# EasyEDA Pro project ProPrj_WirelessUWB_2025-08-06.epro

# Schematic Schematic1
Board Name: Board1; Create Date: 2025-03-13; Page Name: P1; Project Name: WirelessUWB; Schematic Name: Schematic1; Update Date: 2025-07-11; Company: 嘉立创EDA; Page Size: A4; Version: V1.0
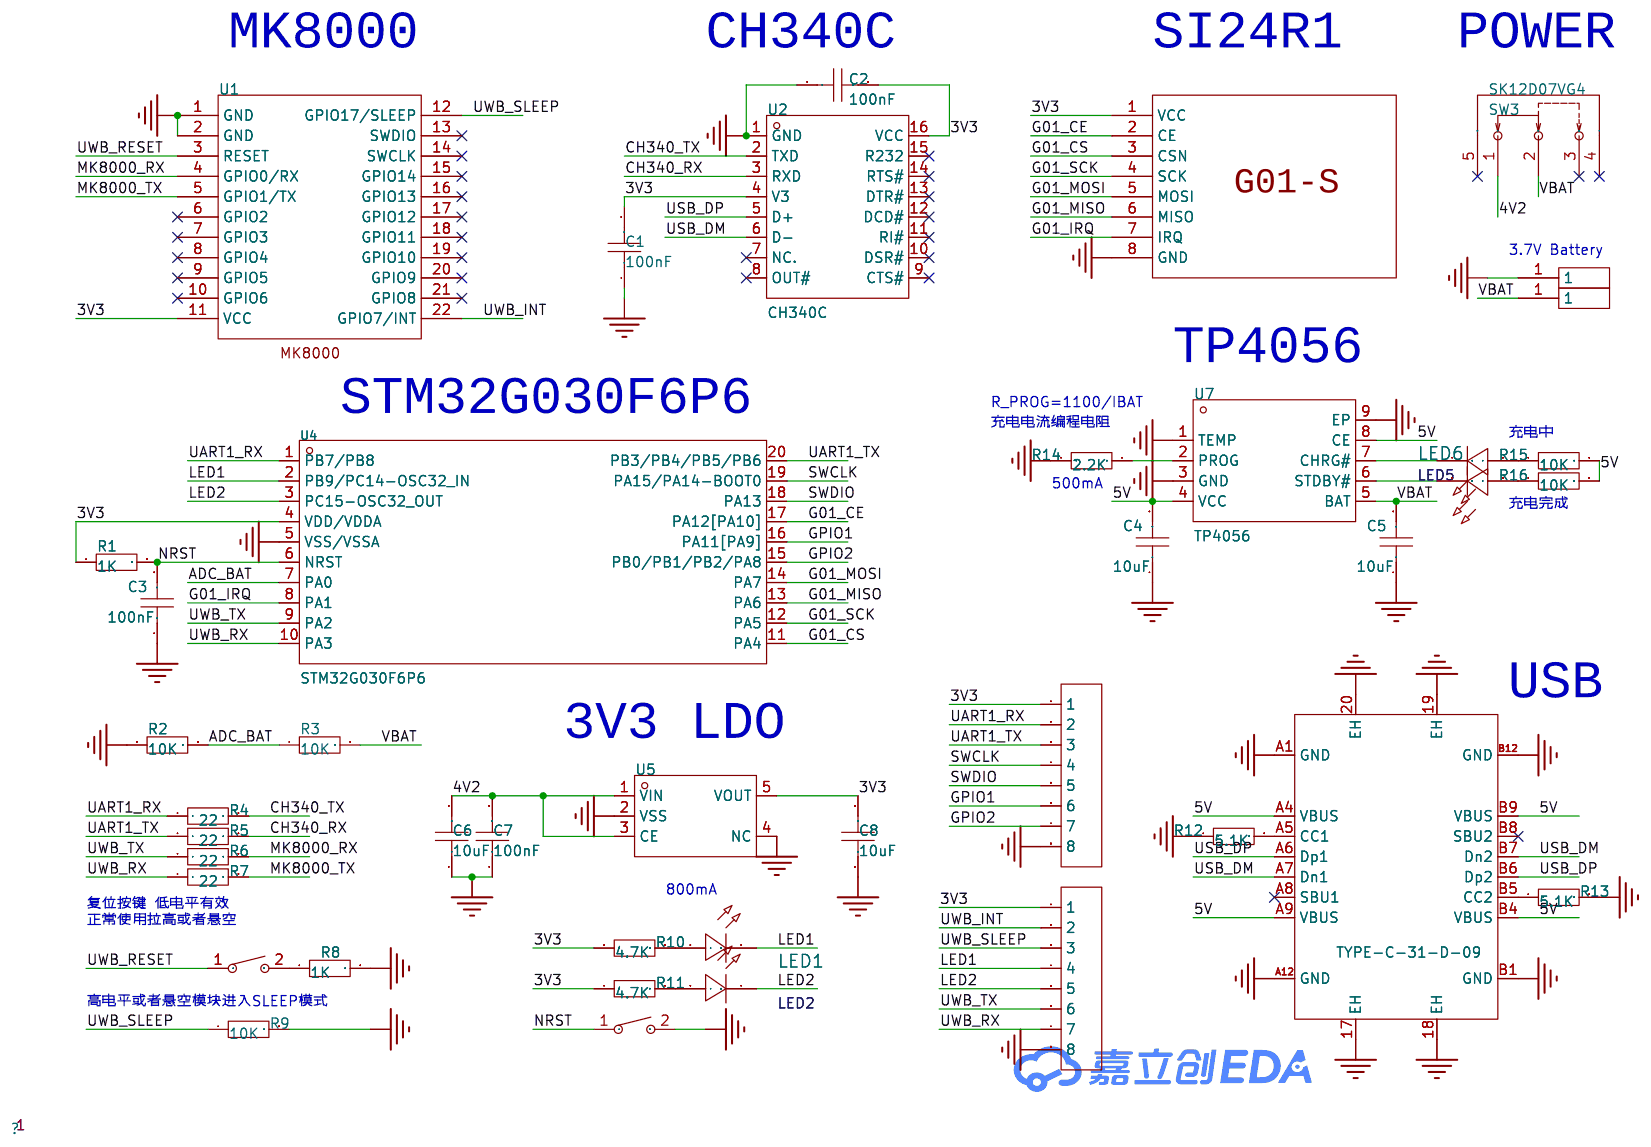
[diagram p0: schematic sheet]

## Parts
C1  100nF  [C0603]
C2  100nF  [C0603]
C3  100nF  [C0603]
C4  10uF  [C0603]
C5  10uF  [C0603]
C6  10uF  [C0603]
C7  100nF  [C0603]
C8  10uF  [C0603]
H1  -  [HDR-TH_8P-P2.54-V-F-1]
H2  -  [HDR-TH_8P-P2.54-V-F-1]
LED1  -  [LED_0603]
LED2  -  [LED_0603]
LED5  -  [LED_0603]
LED6  -  [LED_0603]
R1  1K  [R0603]
R2  10K  [R0603]
R3  10K  [R0603]
R4  22  [R0603]
R5  22  [R0603]
R6  22  [R0603]
R7  22  [R0603]
R8  1K  [R0603]
R9  10K  [R0603]
R10  4.7K  [R0603]
R11  4.7K  [R0603]
R12  5.1K  [R0603]
R13  5.1K  [R0603]
R14  2.2K  [R0603]
R15  10K  [R0603]
R16  10K  [R0603]
SW1  TS342A2P-WZ  [SW-SMD_L4.0-W2.9-LS5.0]
SW2  TS342A2P-WZ  [SW-SMD_L4.0-W2.9-LS5.0]
SW3  SK12D07VG4  [SW-TH_SK12D07VG4]
U1  -  [MK8000]
U2  CH340C  [SOP-16_L10.0-W3.9-P1.27-LS6.0-BL]
U3  -  [G01-S]
U4  STM32G030F6P6  [TSSOP-20_L6.5-W4.4-P0.65-LS6.4-BL]
U5  ME6217C33M5G  [SOT-23-5_L3.0-W1.7-P0.95-LS2.8-BR]
U6  TYPE-C-31-D-09  [USB-C-TH_TYPE-C-31-D-09]
U7  TP4056  [ESOP-8_L4.9-W3.9-P1.27-LS6.0-BL-EP]
U99  -  [1pin焊接引出]
U100  -  [1pin焊接引出]

## Library data of the parts
C1-C3 C6-C8 = CAP_0603: Supplier Footprint: 0603
C4 C5 = CL10A106KP8NNNC: 容值:10uF;精度:±10%;额定电压:10V;材质(温度系数):X5R;; LCSC Part Name: 10uF ±10% 10V; Supplier Part: C19702; Manufacturer: SAMSUNG(三星); Supplier Footprint: 0603; JLCPCB Part Class: Basic Part; Datasheet: https://atta.szlcsc.com/upload/public/pdf/source/20160218/1457707763339.pdf; Supplier: LCSC; Tolerance: ±10%; Voltage Rated: 10V; Temperature Coefficient: X5R
H1 H2 = HDR-F_2.54_1x8P: Supplier Part: C27438; Supplier Footprint: 插件
LED1 LED6 = LED_0603-R: Supplier Footprint: 0603
LED2 = LED_0603-B: Supplier Footprint: 0603
LED5 = LED_0603-G: Supplier Footprint: 0603
R1-R11 = Res_0603: Supplier Footprint: 0603
R12 R13 = 0603WAF5101T5E: 电阻类型:厚膜电阻;阻值:5.1kΩ;精度:±1%;功率:100mW;最大工作电压:75V;温度系数:±100ppm/℃;; LCSC Part Name: 5.1kΩ ±1% 100mW 厚膜电阻; Supplier Part: C23186; Manufacturer: UNI-ROYAL(厚声); Supplier Footprint: 0603; JLCPCB Part Class: Basic Part; Datasheet: https://atta.szlcsc.com/upload/public/pdf/source/20200306/C422600_1E6D84923E4A46A82E41ADD87F860B5C.pdf; Supplier: LCSC; Type: 厚膜电阻; Tolerance: ±1%; Power(Watts): 100mW; Overload Voltage (Max): 75V; Temperature Coefficient: ±100ppm/℃; Operating Temperature Range: -55℃~+155℃
R14 = 0603WAF2201T5E: 电阻类型:厚膜电阻;阻值:2.2kΩ;精度:±1%;功率:100mW;最大工作电压:75V;温度系数:±100ppm/℃;; LCSC Part Name: 2.2kΩ ±1% 100mW 厚膜电阻; Supplier Part: C4190; Manufacturer: UNI-ROYAL(厚声); Supplier Footprint: 0603; JLCPCB Part Class: Basic Part; Datasheet: https://atta.szlcsc.com/upload/public/pdf/source/20200306/C422600_1E6D84923E4A46A82E41ADD87F860B5C.pdf; Supplier: LCSC; Type: 厚膜电阻; Tolerance: ±1%; Power(Watts): 100mW; Overload Voltage (Max): 75V; Temperature Coefficient: ±100ppm/℃; Operating Temperature Range: -55℃~+155℃
R15 R16 = 0603WAF1002T5E: 电阻类型:厚膜电阻;阻值:10kΩ;精度:±1%;功率:100mW;最大工作电压:75V;温度系数:±100ppm/℃;; LCSC Part Name: 厚膜电阻 10kΩ ±1% 100mW; Supplier Part: C25804; Manufacturer: UNI-ROYAL(厚声); Supplier Footprint: 0603; JLCPCB Part Class: Basic Part; Datasheet: https://atta.szlcsc.com/upload/public/pdf/source/20200306/C422600_1E6D84923E4A46A82E41ADD87F860B5C.pdf; Supplier: LCSC; Type: 厚膜电阻; Tolerance: ±1%; Power(Watts): 100mW; Overload Voltage (Max): 75V; Temperature Coefficient: ±100ppm/℃; Operating Temperature Range: -55℃~+155℃
SW1 SW2 = TS342A2P-WZ: 电路结构:单刀单掷;按钮形状:圆形按钮;安装方式:立贴;开关长度:3.95mm;开关宽度:2.9mm;开关高度:2mm;带支架:不带;触点电流:50mA;额定电压(DC):12V;绝缘电阻:100MΩ;机械寿命:3万次;; LCSC Part Name: 3.95*2.9*2mm 立贴 轻触开关; Supplier Part: C557591; Manufacturer: SHOU HAN(首韩); Supplier Footprint: SMD; JLCPCB Part Class: 扩展库; Datasheet: https://atta.szlcsc.com/upload/public/pdf/source/20200519/C557591_B3A5A21584733303F06306F18577DA8B.pdf; Supplier: LCSC; Circuit: 单刀单掷; Actuator Style: 圆形按钮; Mounting Style: 立贴; Switch Length: 3.95mm; Switch Width: 2.9mm; Switch Height: 2mm; Strike Gundam: 不带; Contact Current: 50mA; Voltage Rating (DC): 12V; Insulation Resistance: 100MΩ; Actuator/Cap Color: 黑色; Pin Style: SMD接片; Mechanical Life: 3万次; Operating Temperature: -25℃~+70℃
SW3 = SK12D07VG4: 电路结构:单刀双掷;安装方式:-;额定电流(DC):500mA;额定电压(DC):50V;额定电流(AC):-;额定电压(AC):-;机械寿命:5千次;; LCSC Part Name: 3脚2档位 卧插 滑动开关; Supplier Part: C393937; Manufacturer: SHOU HAN(首韩); Supplier Footprint: 插件; JLCPCB Part Class: 扩展库; Datasheet: https://atta.szlcsc.com/upload/public/pdf/source/20190521/C393937_939FE26E571CC67D2D532E953108A1B0.pdf; Supplier: LCSC; Circuit: 单刀双掷; Actuator Style: 矩形柱状; Pin Style: PC引脚; Switch Height: 8.8mm; Current Rating (DC): 500mA; Voltage Rating (DC): 50V; Mechanical Life: 5千次
U1 = MK8000: UWB模块
U2 = CH340C: 应用功能:收发器;接口协议:USB 2.0;数据速率:2Mbps;; LCSC Part Name: CH340C USB转串口芯片 CH340; Supplier Part: C84681; Manufacturer: WCH(南京沁恒); Supplier Footprint: SOP-16; JLCPCB Part Class: 扩展库; Datasheet: https://atta.szlcsc.com/upload/public/pdf/source/20200819/C84681_ADBED554CE321879DBD6B1D06488689C.pdf; Supplier: LCSC; Applications Function: 收发器; Protocol: USB 2.0; Supply Voltage: 3.3V；5V; Data Rate: 2Mbps
U3 = G01-S
U4 = STM32G030F6P6: CPU内核:CM0;程序存储容量:32KB;RAM总容量:8KB;GPIO端口数量:18;工作电压范围:2V~3.6V;CPU最大主频:64MHz;程序存储器类型:FLASH;; Supplier Part: C724040; Manufacturer: ST(意法半导体); Supplier Footprint: TSSOP-20; JLCPCB Part Class: 扩展库; Datasheet: https://atta.szlcsc.com/upload/public/pdf/source/20200511/C529329_A1CB615556C746C4EA827FCAD1461480.pdf; Supplier: LCSC; CPU Core: CM0; Program Storage Size: 32KB; RAM Size: 8KB; GPIO Ports Number: 18; Operating Voltage Range: 2V~3.6V; CPU Maximum Speed: 64MHz; Program Memory Type: FLASH; Operating Temperature Range: -40℃~+85℃; ADC (Bit): 12bit; Peripheral/Function: DMA；看门狗；看门狗; Internal Oscillator: 有
U5 = ME6217C33M5G: 输出类型:固定;输出极性:正;最大输入电压:7V;输出电压:3.3V;输出电流:800mA;电源纹波抑制比(PSRR):65dB@(1kHz);; Supplier Part: C427602; Manufacturer: MICRONE(南京微盟); Supplier Footprint: SOT-23-5; JLCPCB Part Class: 扩展库; Datasheet: https://atta.szlcsc.com/upload/public/pdf/source/20190910/C427602_D4B9162A2E9D9EF57C60010DFDECEF37.pdf; Supplier: LCSC; Output Type: 固定; Output Polarity: 正; Number of Outputs: 1; Maximum Input Voltage: 7V; Output Voltage: 3.3V; Dropout Voltage: 180mV@(300mA); Output Current: 800mA; Power Supply Rejection Ratio (PSRR): 65dB@(1kHz)
U6 = TYPE-C-31-D-09_C7463258: 连接器类型:Type-C;公母:母;触点数量:16P;端口数量:1;触头材质:磷青铜;触头镀层:金;工作温度范围:-25℃~+85℃;焊接温度(最大值):255℃;; LCSC Part Name: Type-C 母; Supplier Part: C7463258; Manufacturer: 韩国韩荣; Supplier Footprint: 插件; JLCPCB Part Class: 扩展库; Datasheet: https://atta.szlcsc.com/upload/public/pdf/source/20210810/32473655767ED7E058BB8A709ED63A8A.pdf; Supplier: LCSC; Connector Type: Type-C; Gender: 母; Number of Contacts: 16P; Number of Ports: 1; Contact Material: 磷青铜; Contact Plating: 金; Operating Temperature Range: -25℃~+85℃; Soldering Temperature(Max): 255℃
U7 = TP4056_C382139: 工作电压:4V~6V;最大充电电流:1A;电池类型:锂离子/聚合物;电池节数:1;; LCSC Part Name: 1A锂电池充电IC; Supplier Part: C382139; Manufacturer: TPOWER(天源); Supplier Footprint: ESOP-8; JLCPCB Part Class: 扩展库; Datasheet: https://atta.szlcsc.com/upload/public/pdf/source/20190327/C382139_EC85960E6FE3E26856C240C81751A184.pdf; Supplier: LCSC; The Chip Type: 线性充电芯片; Supply Voltage: 4V~6V; Maximum Charge Current: 1A; Charging Saturation Voltage: 4.2V; Type of Battery: 锂离子/聚合物; Number of Cells: 1; Operating Temperature: -40℃~+85℃
U99 U100 = 1pin焊接引出: Check: false

## Nets
3V3: C1.2 C2.2 C8.2 H1.1 H2.1 R1.1 R10.1 R11.1 U1.11(VCC) U2.4(V3) U2.16(VCC) U3.1(VCC) U4.4(VDD/VDDA) U5.5(VOUT)
4V2: C6.2 C7.2 SW3.1 U5.1(VIN) U5.3(CE)
5V: C4.2 R15.2 R16.2 U6.A4(VBUS) U6.A9(VBUS) U6.B4(VBUS) U6.B9(VBUS) U7.4(VCC) U7.8(CE)
GND: C1.1 C2.1 C3.1 C4.1 C5.1 C6.1 C7.1 C8.1 H1.8 H2.8 R2.1 R8.2 R9.2 R12.1 R13.2 R14.1 SW2.2 U1.1(GND) U1.2(GND) U2.1(GND) U3.8(GND) U4.5(VSS/VSSA) U5.2(VSS) U5.4(NC) U6.17(EH) U6.18(EH) U6.19(EH) U6.20(EH) U6.A1(GND) U6.A12(GND) U6.B1(GND) U6.B12(GND) U7.1(TEMP) U7.3(GND) U7.9(EP) U99.1
VBAT: C5.2 R3.2 SW3.2 U7.5(BAT) U100.1
ADC_BAT: R2.2 R3.1 U4.7(PA0)
CH340_RX: R5.2 U2.3(RXD)
CH340_TX: R4.2 U2.2(TXD)
G01_CE: U3.2(CE) U4.17(PA12[PA10])
G01_CS: U3.3(CSN) U4.11(PA4)
G01_IRQ: U3.7(IRQ) U4.8(PA1)
G01_MISO: U3.6(MISO) U4.13(PA6)
G01_MOSI: U3.5(MOSI) U4.14(PA7)
G01_SCK: U3.4(SCK) U4.12(PA5)
GPIO1: H2.6 U4.16(PA11[PA9])
GPIO2: H2.7 U4.15(PB0/PB1/PB2/PA8)
LED1: H1.4 LED1.1(C) U4.2(PB9/PC14-OSC32_IN)
LED2: H1.5 LED2.1(C) U4.3(PC15-OSC32_OUT)
MK8000_RX: R6.2 U1.4(GPIO0/RX)
MK8000_TX: R7.2 U1.5(GPIO1/TX)
NRST: C3.2 R1.2 SW2.1 U4.6(NRST)
SWCLK: H2.4 U4.19(PA15/PA14-BOOT0)
SWDIO: H2.5 U4.18(PA13)
UART1_RX: H2.2 R4.1 U4.1(PB7/PB8)
UART1_TX: H2.3 R5.1 U4.20(PB3/PB4/PB5/PB6)
USB_DM: U2.6(D-) U6.A7(Dn1) U6.B7(Dn2)
USB_DP: U2.5(D+) U6.A6(Dp1) U6.B6(Dp2)
UWB_INT: H1.2 U1.22(GPIO7/INT)
UWB_RESET: SW1.1 U1.3(RESET)
UWB_RX: H1.7 R7.1 U4.10(PA3)
UWB_SLEEP: H1.3 R9.1 U1.12(GPIO17/SLEEP)
UWB_TX: H1.6 R6.1 U4.9(PA2)
$1N3135: LED6.1(C) U7.7(CHRG#)
$1N3136: LED5.1(C) U7.6(STDBY#)
Net-(LED1-2): LED1.2(A) R10.2
Net-(LED2-2): LED2.2(A) R11.2
Net-(LED5-2): LED5.2(A) R16.1
Net-(LED6-2): LED6.2(A) R15.1
Net-(R8-1): R8.1 SW1.2
Net-(R12-2): R12.2 U6.A5(CC1)
Net-(R13-1): R13.1 U6.B5(CC2)
Net-(R14-2): R14.2 U7.2(PROG)

Not connected (* = marked no-connect by the designer): SW3 3* 4* 5*; U1 6(GPIO2)* 7(GPIO3)* 8(GPIO4)* 9(GPIO5)* 10(GPIO6)* 13(SWDIO)* 14(SWCLK)* 15(GPIO14)* 16(GPIO13)* 17(GPIO12)* 18(GPIO11)* 19(GPIO10)* 20(GPIO9)* 21(GPIO8)*; U2 7(NC.)* 8(OUT#)* 9(CTS#)* 10(DSR#)* 11(RI#)* 12(DCD#)* 13(DTR#)* 14(RTS#)* 15(R232)*; U6 A8(SBU1)* B8(SBU2)*

## Notes on the sheet
- MK8000
- CH340C
- SI24R1
- POWER
- 3.7V Battery
- TP4056
- STM32G030F6P6
- R_PROG=1100/IBAT
- 充电电流编程电阻
- 充电中
- 500mA
- 充电完成
- USB
- 3V3 LDO
- 800mA
- 复位按键 低电平有效
  正常使用拉高或者悬空
- 高电平或者悬空模块进入SLEEP模式

# Board PCB1
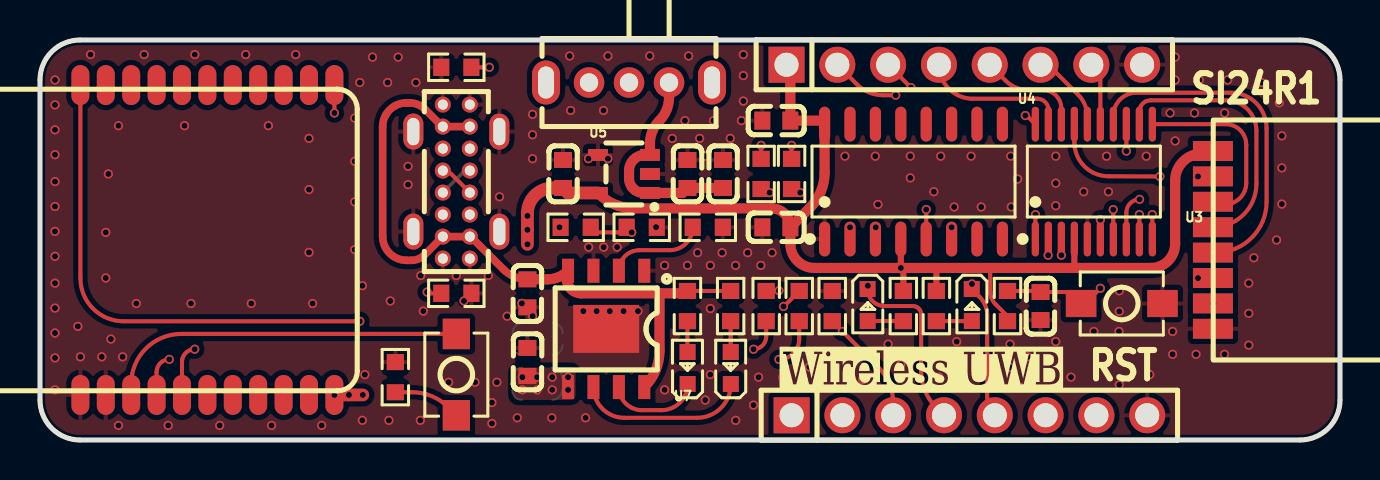
[diagram p1: board, top side]
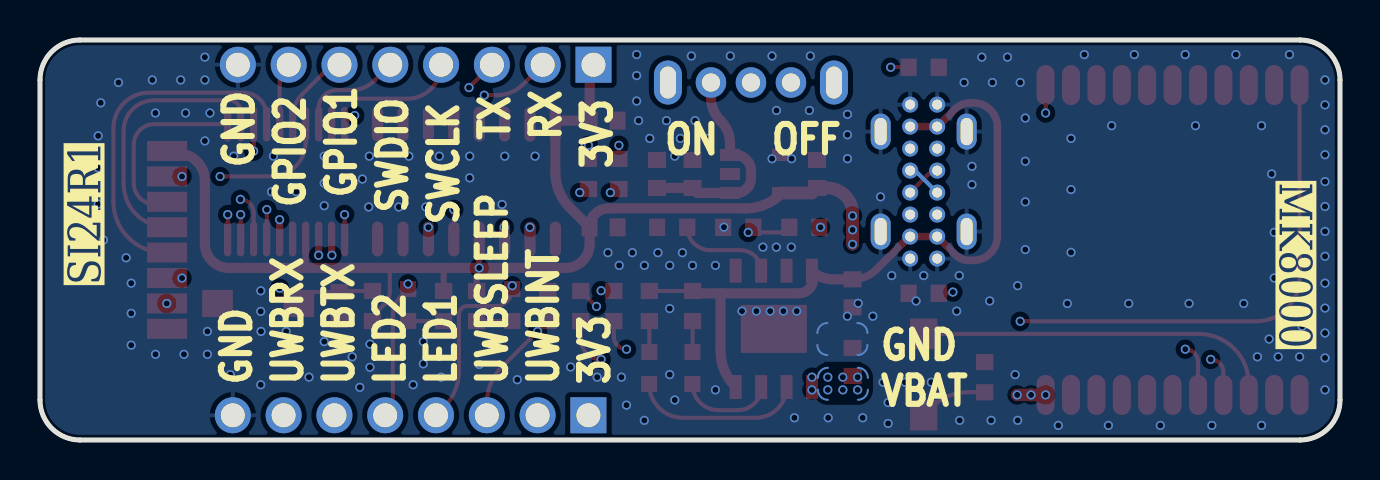
[diagram p2: board, bottom side, seen from below]

Outline 65 x 20 mm; copper layers: Top Layer, Inner1, Inner2, Bottom Layer. Coordinates in mm from the lower left corner of the outline.
Outline path: 0,18 0,2 arc(0.59,0.59) 2,0 63,0 arc(64.41,0.59) 65,2 65,18 arc(64.41,19.41) 63,20 2,20 arc(0.59,19.41) 0,18
Stack: Top Layer 0.035mm 外层铜厚1oz / Dielectric1 0.2104mm 7628 RC49% 8.6mil / Inner1 0.0152mm 内层铜厚 / Dielectric2 1.065mm 1.1mm H/HOZ Copper / Inner2 0.0152mm 内层铜厚 / Dielectric3 0.2104mm 7628 RC49% 8.6mil / Bottom Layer 0.035mm 外层铜厚1oz

## Design rules (mm)
template: 自定义配置
spacing copperThickness1oz (default): track to track 0.102, other pairs 0.152 to 0.3
spacing copperThickness2oz: track to track 0.203, other pairs 0.152 to 0.3
track width copperThickness1oz (default): min 0.127, default 0.254, max 2.54
track width copperThickness2oz: min 0.203, default 0.254, max 2.54
differential pair differentialPair (default): width min 0.127, default 0.254, max 2.54; gap min 0.152, default 0.152
via viaSize (default): diameter min 0.254, default 0.457, max 10; hole min 0.3, default 0.305, max 6.3

## Placement (name value [footprint] x y rotation side)
C9  100nF  [C0603]  50.03 6.7 90 top
C12  100nF  [C0603]  32.37 13.3 270 top
C13  10uF  [C0603]  34.15 13.3 270 top
C14  10uF  [C0603]  26.15 13.3 270 top
C30  10uF  [C0603]  24.37 3.9 270 top
C31  10uF  [C0603]  24.37 7.33 90 top
C68  100nF  [C0603]  36.82 10.64 0 top
C69  100nF  [C0603]  36.82 15.97 0 top
H1  -  [HDR-TH_8P-P2.54-V-F-1]  46.47 1.24 0 top
H2  -  [HDR-TH_8P-P2.54-V-F-1]  46.22 18.76 0 top
LED1  -  [LED_0603]  41.39 6.7 270 top
LED2  -  [LED_0603]  46.6 6.7 270 top
LED5  -  [LED_0603]  34.53 3.65 90 top
LED6  -  [LED_0603]  32.37 3.65 90 top
R1  1K  [R0603]  17.77 3.14 90 top
R2  10K  [R0603]  39.61 6.7 90 top
R4  22  [R0603]  33.39 10.64 180 top
R5  22  [R0603]  48.38 6.7 90 top
R6  22  [R0603]  43.17 6.7 270 top
R7  22  [R0603]  44.82 6.7 270 top
R8  1K  [R0603]  30.09 10.64 180 top
R9  10K  [R0603]  26.78 10.64 180 top
R46  5.1K  [R0603]  20.82 7.33 180 top
R47  5.1K  [R0603]  20.82 18.64 180 top
R48  10K  [R0603]  32.37 6.7 90 top
R49  10K  [R0603]  34.53 6.7 90 top
R50  22  [R0603]  36.06 13.3 270 top
R51  22  [R0603]  37.58 13.3 270 top
R52  22  [R0603]  37.96 6.7 270 top
R53  22  [R0603]  36.31 6.7 270 top
SW1  TS342A2P-WZ  [SW-SMD_L4.0-W2.9-LS5.0]  20.82 3.27 270 top
SW2  TS342A2P-WZ  [SW-SMD_L4.0-W2.9-LS5.0]  54.09 6.83 0 top
SW3  SK12D07VG4  [SW-TH_SK12D07VG4]  29.45 17.87 180 top
U1  -  [MK8000]  15.86 10 90 top
U2  CH340C  [SOP-16_L10.0-W3.9-P1.27-LS6.0-BL]  43.68 12.92 0 top
U3  -  [G01-S]  58.66 10 0 top
U4  STM32G030F6P6  [TSSOP-20_L6.5-W4.4-P0.65-LS6.4-BL]  52.69 12.92 0 top
U5  ME6217C33M5G  [SOT-23-5_L3.0-W1.7-P0.95-LS2.8-BR]  29.2 13.3 0 top
U6  TYPE-C-31-D-09  [USB-C-TH_TYPE-C-31-D-09]  20.82 12.92 90 top
U7  TP4056  [ESOP-8_L4.9-W3.9-P1.27-LS6.0-BL-EP]  28.31 5.56 180 top
U99  -  [1pin焊接引出]  24.88 5.05 0 bottom
U100  -  [1pin焊接引出]  24.86 2.81 0 bottom

## Footprints (pads in the part's own frame, mm; a bottom-side part is the same pattern mirrored in y, then rotated)
1pin焊接引出
  custom 2.5x1.6 smd: 1(0,0)
C0603
  rect 0.8x0.9 smd: 1(-0.7,0) 2(0.7,0)
ESOP-8_L4.9-W3.9-P1.27-LS6.0-BL-EP
  rect 0.6x1.2 smd: 1(-1.905,-2.909) 2(-0.635,-2.909) 3(0.635,-2.909) 4(1.905,-2.909) 5(1.905,2.909) 6(0.635,2.909) 7(-0.635,2.909) 8(-1.905,2.909)
  rect 3.3x2.4 smd: 9(0,0)
G01-S
  custom 2x1 smd: 1(-0.016,4.45) 2(-0.016,3.18) 3(-0.016,1.91) 4(-0.016,0.64) 5(-0.016,-0.63) 6(-0.016,-1.9) 7(-0.016,-3.17) 8(-0.016,-4.44)
HDR-TH_8P-P2.54-V-F-1
  rect 1.8x1.8 hole 1.2: 1(-8.89,0)
  round 1.8 hole 1.2: 2(-6.35,0) 3(-3.81,0) 4(-1.27,0) 5(1.27,0) 6(3.81,0) 7(6.35,0) 8(8.89,0)
LED_0603
  rect 0.8x0.8 smd: 1(-0.851,-0.01) 2(0.75,-0.005)
MK8000
  oval 2x0.9 smd: 1(-7.747,13.843) 2(-7.747,12.573) 3(-7.747,11.303) 4(-7.747,10.033) 5(-7.747,8.763) 6(-7.747,7.493) 7(-7.747,6.223) 8(-7.747,4.953) 9(-7.747,3.683) 10(-7.747,2.413) 11(-7.747,1.143) 12(7.747,13.843) 13(7.747,12.573) 14(7.747,11.303) 15(7.747,10.033) 16(7.747,8.763) 17(7.747,7.493) 18(7.747,6.223) 19(7.747,4.953) 20(7.747,3.683) 21(7.747,2.413) 22(7.747,1.143)
R0603
  rect 0.806x0.864 smd: 1(-0.753,0) 2(0.753,0)
SOP-16_L10.0-W3.9-P1.27-LS6.0-BL
  oval 0.56x1.745 smd: 1(-4.445,-2.873) 2(-3.175,-2.873) 3(-1.905,-2.873) 4(-0.635,-2.873) 5(0.635,-2.873) 6(1.905,-2.873) 7(3.175,-2.873) 8(4.445,-2.873) 9(4.445,2.873) 10(3.175,2.873) 11(1.905,2.873) 12(0.635,2.873) 13(-0.635,2.873) 14(-1.905,2.873) 15(-3.175,2.873) 16(-4.445,2.873)
SOT-23-5_L3.0-W1.7-P0.95-LS2.8-BR
  rect 1x0.6 smd: 1(1.3,-0.95) 2(1.3,0) 3(1.3,0.95) 4(-1.3,0.95) 5(-1.3,-0.95)
SW-SMD_L4.0-W2.9-LS5.0
  rect 1.53x1.36 smd: 1(-2.035,0) 2(2.035,0)
SW-TH_SK12D07VG4
  round 1.524 hole 0.914: 1(-2,0) 2(0,0) 3(2,0)
  oval 1.4x2.2 hole 0.8x1.6: 4(4.15,0) 5(-4.15,0)
TSSOP-20_L6.5-W4.4-P0.65-LS6.4-BL
  oval 0.364x1.742 smd: 1(-2.925,-2.871) 2(-2.275,-2.871) 3(-1.625,-2.871) 4(-0.975,-2.871) 5(-0.325,-2.871) 6(0.325,-2.871) 7(0.975,-2.871) 8(1.625,-2.871) 9(2.275,-2.871) 10(2.925,-2.871) 11(2.925,2.871) 12(2.275,2.871) 13(1.625,2.871) 14(0.975,2.871) 15(0.325,2.871) 16(-0.325,2.871) 17(-0.975,2.871) 18(-1.625,2.871) 19(-2.275,2.871) 20(-2.925,2.871)
USB-C-TH_TYPE-C-31-D-09
  oval 1.8x1 hole 1.365x0.6: 17(2.5,2.15) 18(-2.5,2.15) 19(-2.5,-2.15) 20(2.5,-2.15)
  round 0.8 hole 0.5: A1(-3.85,0.675) A4(-2.75,0.675) A5(-1.65,0.675) A6(-0.55,0.675) A7(0.55,0.675) A8(1.65,0.675) A9(2.75,0.675) A12(3.85,0.675) B1(3.85,-0.675) B4(2.75,-0.675) B5(1.65,-0.675) B6(0.55,-0.675) B7(-0.55,-0.675) B8(-1.65,-0.675) B9(-2.75,-0.675) B12(-3.85,-0.675)

## Nets
3V3: C14.2 C68.2 C69.2 H1.1 H2.1 R5.1 R6.1 R7.1 U1.11 U2.4 U2.16 U3.1 U4.4 U5.5
4V2: C12.2 C13.2 SW3.1 U5.1 U5.3
5V: C31.2 R48.2 R49.2 U6.A4 U6.A9 U6.B4 U6.B9 U7.4 U7.8
GND: C9.1 C12.1 C13.1 C14.1 C30.1 C31.1 C68.1 C69.1 H1.8 H2.8 R1.2 R2.2 R4.1 R8.1 R46.1 R47.2 SW2.2 U1.1 U1.2 U2.1 U3.8 U4.5 U5.2 U5.4 U6.17 U6.18 U6.19 U6.20 U6.A1 U6.A12 U6.B1 U6.B12 U7.1 U7.3 U7.9 U99.1
VBAT: C30.2 R9.2 SW3.2 U7.5 U100.1
ADC_BAT: R8.2 R9.1 U4.7
CH340_RX: R51.2 U2.3
CH340_TX: R50.2 U2.2
G01_CE: U3.2 U4.17
G01_CS: U3.3 U4.11
G01_IRQ: U3.7 U4.8
G01_MISO: U3.6 U4.13
G01_MOSI: U3.5 U4.14
G01_SCK: U3.4 U4.12
GPIO1: H2.6 U4.16
GPIO2: H2.7 U4.15
LED1: H1.4 LED1.1 U4.2
LED2: H1.5 LED2.1 U4.3
MK8000_RX: R52.2 U1.4
MK8000_TX: R53.2 U1.5
NRST: C9.2 R5.2 SW2.1 U4.6
SWCLK: H2.4 U4.19
SWDIO: H2.5 U4.18
UART1_RX: H2.2 R50.1 U4.1
UART1_TX: H2.3 R51.1 U4.20
USB_DM: U2.6 U6.A7 U6.B7
USB_DP: U2.5 U6.A6 U6.B6
UWB_INT: H1.2 U1.22
UWB_RESET: SW1.1 U1.3
UWB_RX: H1.7 R53.1 U4.10
UWB_SLEEP: H1.3 R2.1 U1.12
UWB_TX: H1.6 R52.1 U4.9
$1N736: R1.1 SW1.2
$1N2070: LED1.2 R6.2
$1N2071: LED2.2 R7.2
$1N2718: R46.2 U6.A5
$1N2719: R47.1 U6.B5
$1N3128: R4.2 U7.2
$1N3135: LED6.1 U7.7
$1N3136: LED5.1 U7.6
$1N3139: LED6.2 R48.1
$1N3145: LED5.2 R49.1

Pads without a net: SW3 3 4 5; U1 6 7 8 9 10 13 14 15 16 17 18 19 20 21; U2 7 8 9 10 11 12 13 14 15; U6 A8 B8

## Via types
v1: diameter 0.457, hole 0.305, Top Layer to Bottom Layer, 239 vias

## Routing (per net, layer and track width the routed paths; a pad name or vN(x,y) marks a point on that pad's centre or on a via; arc(x,y) is an arc through that point)
3V3: length 87.3
  Top Layer w0.203: 47.51,8.48 47.51,7.43 arc(47.58,7.09) 47.77,6.79 48.38,6.19 R5.1
  Top Layer w0.305: U2.4 v1(43.04,8.6) 43.04,8.49 ; 51.72,8.51 U4.4 ; R7.1 44.82,8.48 ; R6.1 43.17,8.36
  Top Layer w0.508: 58.28,14.45 U3.1 ; U5.5 27.93,12.32 arc(28.36,11.97) 28.87,11.73 arc(29.29,11.62) 29.72,11.58 36.57,11.58 arc(37.24,11.3) C68.2 ; 51.7,8.6 55.56,8.6 arc(56.4,8.96) 56.76,9.81 56.76,12.97 arc(57.15,13.92) 58.1,14.32 58.28,14.32 ; C68.2 37.52,9.81 arc(37.87,8.96) 38.72,8.6 v1(43.04,8.6) 51.56,8.6 ; C68.2 38.51,11.63 arc(39.04,12.43) 39.23,13.36 U2.16 39.06,15.97 C69.2 37.52,18.57 H2.1
  Top Layer w0.635: v1(14.72,2.25) v1(15.45,2.25) v1(16.14,2.25) ; U5.5 26.4,12.35 C14.2 25.64,12.6 arc(24.74,12.23) 24.37,11.33 v1(24.37,10.51) v1(24.37,9.78)
  Inner2 w0.381: v1(43.04,8.6) 43.04,7.88 arc(42.85,6.9) 42.3,6.08 37.67,1.45 arc(37.6,1.35) H1.1
  Inner2 w0.635: v1(24.37,11.2) v1(24.37,10.51) 24.37,9.66 arc(24.18,8.68) 23.63,7.86 18.77,3 arc(17.94,2.45) 16.97,2.25 v1(16.14,2.25) v1(15.45,2.25) v1(14.72,2.25)
4V2: length 11
  Top Layer w0.508: C13.2 C12.2 32.12,12.35 U5.1 30.18,12.35 arc(29.96,12.39) 29.76,12.49 arc(29.67,12.57) 29.59,12.66 arc(29.49,12.86) 29.45,13.08 29.45,13.46 arc(29.68,14.02) 30.24,14.25 U5.3 30.5,14.83 arc(30.62,15.44) 30.97,15.96 arc(31.33,16.5) 31.45,17.13 SW3.1
5V: length 36.2
  Top Layer w0.203: R48.2 R49.2
  Top Layer w0.381: U6.B4 U6.A9 20.12,15.67 19.25,16.53 arc(18.89,16.77) 18.47,16.86 18.33,16.86 arc(18.02,16.82) 17.74,16.7 arc(17.48,16.51) 17.29,16.25 arc(17.17,15.97) 17.13,15.66 17.13,10.18 arc(17.48,9.33) 18.33,8.98 18.57,8.98 arc(18.93,9.05) 19.23,9.26 U6.A4 U6.B9 21.53,10.17 23.18,8.53 arc(23.73,8.16) C31.2
  Top Layer w0.508: R48.2 32.25,7.33 30.97,7.33 ; 26.4,8.09 U7.4 arc(25.93,8.14) 25.37,8.03 C31.2 ; 30.97,7.33 30.98,7.32 30.98,4.46 arc(30.78,3.49) 30.23,2.67 U7.8 ; 30.97,7.33 27.06,7.33 arc(26.55,7.54) 26.34,8.05
GND:
  vias: v1(0.75,18) v1(0.75,16.76) v1(0.75,15.51) v1(0.75,14.26) v1(0.75,12.92) v1(0.75,11.68) v1(0.75,10.43) v1(0.75,9.18) v1(0.75,7.84) v1(0.75,6.6) v1(0.75,5.35) v1(0.75,4.1) v1(0.75,2.51) v1(1.89,5.68) v1(2.02,4.16) v1(2.53,19.27) v1(3.09,4.16) v1(3.29,10.38) v1(3.29,8.1) v1(3.42,13.3) v1(3.54,5.05) v1(3.92,15.72) v1(3.92,0.73) v1(4.13,4.16) v1(4.81,6.83) v1(5.21,19.27) v1(6.41,0.73) v1(7.23,15.72) v1(7.55,6.83) v1(7.74,19.27) v1(8.98,0.73) v1(10.28,19.27) v1(10.56,6.83) v1(11.42,15.72) v1(11.58,0.73) v1(12.78,19.27) v1(13.45,15.08) v1(13.45,12.52) v1(13.45,9.38) v1(13.63,6.83) v1(14.08,0.73) v1(15.74,16.1) v1(15.74,13.94) v1(15.74,11.91) v1(15.74,9.52) v1(15.99,17.87) v1(16.12,7.71) v1(16.12,0.98) v1(16.24,3.27) v1(16.62,19.14) v1(17.38,17.87) v1(17.45,0.98) v1(17.51,6.95) v1(17.91,19.14) v1(18.4,13.68) v1(18.4,12.77) v1(18.79,17.87) v1(19.04,8.22) v1(19.02,0.98) v1(19.16,6.44) v1(20.44,2.89) v1(20.81,8.22) v1(21.2,6.95) v1(21.75,2.89) v1(22.42,8.22) v1(22.59,1.87) v1(22.59,0.83) v1(22.84,2.89) v1(22.97,12.16) v1(23.36,6.19) v1(23.86,1.11) v1(24.09,6.83) v1(24.63,16.28) v1(24.63,15.26) v1(24.63,14.06) v1(24.63,6.19) v1(25.59,1.11) v1(26.48,19.2) v1(26.53,16.48) v1(27.17,6.44) v1(27.28,1.11) v1(27.42,14.06) v1(27.44,9.64) v1(27.83,6.44) v1(28.18,16.48) v1(28.18,9.64) v1(28.4,19.2) v1(28.4,14.06) v1(28.49,6.44) v1(28.85,9.64) v1(29.18,6.44) v1(29.9,6.44) v1(30.49,19.2) v1(30.8,10.64) v1(31.23,8.73) v1(31.23,2.51) v1(31.61,15.08) v1(32.25,15.97) v1(32.43,19.2) v1(32.37,8.73) v1(32.88,9.36) v1(32.98,15.08) v1(33.26,14.19) v1(33.26,2) v1(33.52,8.73) v1(33.52,6.57) v1(33.52,3.27) v1(33.67,15.97) v1(34.1,9.36) v1(34.51,15.08) v1(34.78,8.73) v1(34.79,0.98) v1(35.07,15.97) v1(35.17,19.27) v1(35.17,18.22) v1(35.17,16.95) v1(35.38,9.36) v1(35.68,1.75) v1(35.93,3.14) v1(36.04,8.73) v1(36.6,9.36) v1(37.14,3.14) v1(38.47,3.65) v1(40.25,14.19) v1(41.14,3.02) v1(41.76,14.19) v1(41.9,11.78) v1(42.41,4.79) v1(43.04,3.78) v1(43.51,14.19) v1(43.51,13.11) v1(44.69,12.41) v1(44.95,3.14) v1(45.04,14.19) v1(45.71,11.65) v1(45.84,4.92) v1(45.84,3.81) v1(46.34,2.76) v1(46.55,14.19) v1(47.06,11.65) v1(48.53,14.19) v1(48.5,4.79) v1(48.5,3.64) v1(48.56,11.65) v1(48.88,13.05) v1(49.01,2.63) v1(49.39,4.16) v1(50.79,14.19) v1(50.79,12.84) v1(50.79,11.71) v1(50.79,4.92) v1(51.55,3.14) v1(52.19,12.41) v1(52.69,5.43) v1(53.33,14.19) v1(53.42,12.41) v1(53.95,5.43) v1(53.96,7.46) v1(53.96,6.43) v1(53.96,2.76) v1(55.31,14.19) v1(55.49,3.27) v1(56.5,16.35) v1(56.63,5.43) v1(56.63,4.28) v1(56.76,19.14) v1(56.76,18) v1(56.76,14.95) v1(57.72,16.35) v1(57.8,4.28) v1(57.97,18) v1(59.23,16.35) v1(59.23,4.28) v1(59.38,18) v1(60.44,7.84) v1(60.44,6.33) v1(60.44,4.74) v1(60.69,9.11) v1(61.07,17.87) v1(61.83,10) v1(61.96,16.86) v1(62.09,15.21) v1(62.09,13.61) v1(62.09,11.8)
VBAT: length 2.4
  Inner2 w1.27: SW3.2 29.45,15.46
  vias: v1(24.12,3.14) v1(24.12,2.51) v1(24.86,3.14) v1(24.86,2.51) v1(25.61,3.14) v1(25.61,2.51) v1(25.97,10.64) v1(26.4,3.14) v1(26.4,2.5)
ADC_BAT: length 28.2
  Top Layer w0.203: R9.1 27.79,10.38 v1(29.59,10.38) ; v1(53.66,11.52) 53.66,10.06 U4.7
  Inner1 w0.203: v1(53.66,11.52) 52.82,11.52 arc(52.75,11.52) 52.68,11.52 arc(51.93,11.33) 51.3,10.89 51.15,10.74 arc(50.33,10.19) 49.35,10 30.51,10 arc(30.01,10.1) v1(29.59,10.38)
CH340_RX: length 4.4
  Inner1 w0.203: v1(38.01,12.37) 38.02,12.38 38.99,12.38 arc(39.96,12.19) 40.79,11.64 v1(41.79,10.64)
CH340_TX: length 4.5
  Inner1 w0.203: v1(40.5,10.64) 40.06,11.07 arc(39.24,11.63) 38.27,11.82 37.81,11.82 arc(37.09,11.96) v1(36.48,12.37)
G01_CE: length 8.1
  Top Layer w0.203: U4.17 51.72,14.89 arc(52.22,13.69) 53.42,13.19 v1(56,13.17)
  Inner1 w0.203: v1(56,13.17) v1(57.9,13.17)
G01_CS: length 9.5
  Top Layer w0.203: U4.11 59.28,15.79 arc(60.01,15.49) 60.31,14.76 60.31,12.85 arc(60.3,12.66) 60.24,12.47 arc(60,12.1) 59.63,11.85 arc(59.44,11.8) 59.24,11.78 58.77,11.78 U3.3
G01_IRQ: length 10.8
  Top Layer w0.203: U4.8 54.32,11.37 arc(54.51,11.84) v1(54.98,12.03)
  Inner1 w0.203: v1(58.66,6.83) 58.66,11.02 arc(58.36,11.73) 57.65,12.03 v1(54.98,12.03)
G01_MISO: length 11.3
  Top Layer w0.203: U4.13 v1(54.32,14.44) ; U3.6 58.64,8.09 v1(57.9,8.09)
  Inner1 w0.203: v1(54.32,14.44) 54.32,9.86 arc(54.83,8.61) 56.08,8.09 v1(57.9,8.09)
G01_MOSI: length 17.6
  Top Layer w0.203: U3.5 58.79,9.37 arc(59.27,9.42) 59.74,9.56 arc(60.58,10.11) 61.14,10.96 arc(61.28,11.42) 61.33,11.91 61.33,15.59 arc(60.81,16.85) 59.55,17.37 54.82,17.37 arc(54.01,17.03) 53.67,16.21 U4.14
G01_SCK: length 13.7
  Top Layer w0.203: U4.12 54.97,16.42 arc(54.98,16.53) 55.01,16.64 arc(55.13,16.82) 55.32,16.94 arc(55.42,16.97) 55.53,16.98 59.3,16.98 arc(60.37,16.54) 60.82,15.46 60.82,12.81 arc(60.18,11.28) U3.4
GPIO1: length 3.7
  Top Layer w0.203: 50.41,18.76 51.91,17.26 arc(52.25,16.75) 52.37,16.15 U4.16
GPIO2: length 2.5
  Top Layer w0.203: U4.15 53.02,18.31
LED1: length 18.7
  Top Layer w0.203: H1.4 44.8,1.64 arc(44.25,2.46) 44.06,3.43 44.06,6.28 arc(44.04,6.41) 43.98,6.52 arc(43.93,6.58) 43.88,6.62 arc(43.76,6.68) 43.64,6.7 42.23,6.7 arc(41.63,6.95) LED1.1 41.39,7.56 v1(41.39,7.71)
  Inner1 w0.203: v1(50.41,9.24) 43.42,9.24 arc(42.16,8.8) v1(41.39,7.71)
LED2: length 13
  Top Layer w0.203: 46.6,7.54 46.98,7.16 arc(47.17,6.91) 47.3,6.63 arc(47.34,6.44) 47.36,6.24 47.36,2.16 arc(47.46,1.66) H1.5 ; 46.6,7.54 LED2.1 ; 46.6,7.54 v1(46.6,7.8) ; U4.3 v1(51.07,9.24)
  Inner1 w0.203: v1(46.6,7.8) arc(47,8.51) 47.78,8.73 50.56,8.73 arc(50.92,8.88) v1(51.07,9.24)
MK8000_RX: length 35.1
  Top Layer w0.203: U1.4 5.83,3.4 arc(6.02,3.85) v1(6.47,4.03) ; R52.2 37.96,5.05 arc(37.66,4.33) v1(36.94,4.03)
  Inner1 w0.203: v1(6.47,4.03) v1(36.94,4.03)
MK8000_TX: length 32.4
  Top Layer w0.203: R53.2 36.31,5.17 arc(36.12,4.72) v1(35.68,4.54) ; U1.5 7.1,3.9 arc(7.1,3.98) 7.12,4.05 arc(7.29,4.35) 7.59,4.52 arc(7.66,4.53) v1(7.73,4.54)
  Inner1 w0.203: v1(7.73,4.54) v1(35.68,4.54)
NRST: length 9.6
  Top Layer w0.203: U4.6 v1(53.02,11.02) ; v1(53.02,7.59) 52.26,6.83 SW2.1 51.48,7.4 C9.2 49.97,7.45 R5.2
  Inner1 w0.203: v1(53.02,11.02) v1(53.02,7.59)
SWCLK: length 6.8
  Top Layer w0.203: 50.43,16.5 arc(50.42,16.54) 50.42,16.59 arc(50.23,16.93) 49.86,17.06 46.65,17.06 arc(45.44,17.56) H2.4
SWDIO: length 5.3
  Top Layer w0.203: U4.18 51.07,16.58 arc(50.8,17.23) 50.15,17.49 49.44,17.49 arc(48.81,17.62) 48.28,17.97 H2.5
UART1_RX: length 23
  Top Layer w0.203: U4.1 49.77,11.27 v1(49.77,11.27) ; H2.2 40.85,17.78 arc(41.45,17.38) 42.15,17.24 v1(42.79,17.24) ; v1(36.06,14.73) R50.1
  Inner1 w0.203: v1(49.77,11.27) 49.77,13.72 arc(49.19,15.13) 47.77,15.72 45.36,15.72 arc(44.39,15.91) 43.57,16.46 v1(42.79,17.24) ; v1(36.06,14.73) 36.06,15.72 arc(36.5,16.79) 37.58,17.24 38.34,17.24 arc(38.46,17.24) 38.58,17.26 arc(39.42,17.69) 39.85,18.52 arc(39.86,18.64) H2.2
UART1_TX: length 16.5
  Top Layer w0.203: H2.3 v1(43.55,17.62) ; v1(37.58,14.73) R51.1 ; v1(49.26,16.22) 49.34,16.22 U4.20
  Inner1 w0.203: v1(43.55,17.62) 44.2,16.97 arc(45.03,16.42) 46,16.22 v1(49.26,16.22) ; v1(37.58,14.73) 37.58,15.33 arc(37.99,16.32) 38.98,16.73 40.37,16.73 arc(41.81,17.33) H2.3
USB_DM: length 27.3
  Top Layer w0.203: U6.B7 20.57,13.29 arc(20.37,13.42) U6.A7 ; v1(45.58,10.64) U2.6
  Inner1 w0.203: v1(45.58,10.64) 45.09,10.64 arc(45.03,10.64) 44.98,10.64 arc(44.07,10.85) 43.29,11.38 42.54,12.13 arc(41.71,12.68) 40.74,12.88 22.71,12.88 arc(22.05,12.74) U6.B7
USB_DP: length 26.5
  Top Layer w0.203: v1(44.31,11.52) 44.31,10.05
  Inner1 w0.203: U6.B6 arc(21.68,13.35) 21.9,13.3 40.97,13.3 arc(41.95,13.11) 42.77,12.56 43.44,11.88 arc(43.84,11.62) v1(44.31,11.52)
  Bottom Layer w0.203: U6.A6 21.24,13.47
UWB_INT: length 40
  Top Layer w0.203: v1(14.72,16.35) U1.22
  Inner1 w0.203: H1.2 40.12,2.51 arc(39.99,3.31) 39.61,4.03 arc(39.38,4.3) 39.1,4.54 arc(38.38,4.92) 37.58,5.05 16.55,5.05 arc(16.28,5.07) 16.02,5.13 arc(15.26,5.58) 14.8,6.34 arc(14.74,6.61) 14.72,6.88 v1(14.72,16.35)
UWB_RESET: length 18.2
  Top Layer w0.203: SW1.1 7.06,5.3 arc(5.29,4.57) 4.56,2.8 U1.3
UWB_RX: length 33.1
  Top Layer w0.203: v1(55.61,11.27) 55.61,10.05 U4.10 ; R53.1 36.32,7.46 v1(36.94,7.46)
  Inner1 w0.203: H1.7 52.82,1.75 arc(51.22,5.61) 47.36,7.21 37.57,7.21 arc(37.23,7.27) v1(36.94,7.46)
  Inner2 w0.203: H1.7 52.82,2.51 arc(53.23,3.49) 54.22,3.9 arc(55.2,4.31) 55.61,5.3 v1(55.61,11.27)
UWB_SLEEP: length 55
  Top Layer w0.203: H1.3 42.66,1.84 arc(42.47,2.82) 41.92,3.64 R2.1 ; U1.12 2.02,8.09 arc(2.65,6.57) 4.18,5.94 v1(15.99,5.94)
  Inner1 w0.203: v1(15.99,5.94) arc(16.43,5.64) 16.94,5.54 39.85,5.54 arc(39.99,5.51) v1(40.12,5.43)
UWB_TX: length 32.7
  Top Layer w0.203: U4.9 v1(54.97,11.27) ; 37.19,6.68 R52.1
  Inner1 w0.203: H1.6 50.28,3.4 arc(49.31,5.73) 46.98,6.7 37.22,6.7 arc(37.2,6.69) v1(37.18,6.68)
  Inner2 w0.203: v1(54.97,11.27) 54.97,5.42 arc(54.71,4.8) 54.09,4.54 52.82,4.54 arc(51.02,3.8) 50.28,2 H1.6
$1N736: length 3.4
  Top Layer w0.203: SW1.2 20.41,1.64 arc(19.58,2.2) 18.61,2.39 R1.1
$1N2070: length 1.8
  Top Layer w0.203: R6.2 43.16,5.95 LED1.2
$1N2071: length 1.8
  Top Layer w0.203: R7.2 46.59,5.94 LED2.2
$1N2718: length 8.4
  Top Layer w0.203: v1(19.36,7.4) 19.42,7.33 R46.2
  Inner1 w0.203: U6.A5 19.9,11.51 arc(19.71,11.67) 19.49,11.79 arc(19.23,11.88) 18.96,11.91 18.69,11.91 arc(18.04,11.64) 17.77,10.98 17.77,8.86 arc(18.21,7.78) 19.29,7.33
$1N2719: length 8.8
  Top Layer w0.203: v1(22.47,18.64) R47.1
  Inner1 w0.203: v1(22.47,18.64) 22.97,18.64 arc(23.69,18.34) 23.99,17.62 23.99,14.97 arc(23.72,14.33) 23.08,14.06 22.72,14.06 arc(22.4,14.09) 22.1,14.18 arc(21.77,14.34) U6.B5
$1N3128: length 4.9
  Top Layer w0.203: U7.2 arc(28.96,8.62) 28.99,8.78 arc(29.25,9.19) 29.66,9.44 arc(29.81,9.48) 29.97,9.49 31.49,9.49 arc(32.3,9.83) R4.2
$1N3135: length 4.8
  Top Layer w0.203: U7.7 arc(28.97,2.38) 29.06,2.13 arc(29.28,1.83) 29.59,1.61 arc(29.84,1.52) 30.1,1.49 31.07,1.49 arc(32,1.87) 32.38,2.8
$1N3136: length 8.7
  Top Layer w0.203: U7.6 arc(27.68,2.5) 27.7,2.35 arc(28.12,1.56) 28.92,1.14 arc(29.06,1.12) 29.21,1.11 32.85,1.11 arc(34.05,1.6) LED5.1
$1N3139: length 1.5
  Top Layer w0.203: R48.1 32.37,4.4 LED6.2
$1N3145: length 1.5
  Top Layer w0.203: R49.1 34.53,4.4 LED5.2

## Copper pours and planes (outline as drawn; the poured copper is in the pictures)
GND on Top Layer: 26.09,6.7 30.34,6.7 30.34,4.03 26.09,4.03
GND on Top Layer: -2.93,23.97 69.08,23.97 69.08,-3.97 -2.93,-3.97
GND on Bottom Layer: -3.19,23.33 69.33,23.33 69.33,-5.11 -3.19,-5.11
GND on Bottom Layer: 22.51,6.83 27.29,6.83 27.29,3.91 22.51,3.91
GND on Inner1: -3.06,23.84 68.95,23.84 68.95,-4.73 -3.06,-4.73
GND on Inner2: -3.44,23.97 69.58,23.97 69.58,-5.37 -3.44,-5.37
VBAT on Top Layer: 23.66,3.62 26.78,3.62 26.78,2 23.66,2
VBAT on Inner2: 25.25,15.94 30.09,15.94 30.09,14.7 25.25,14.7
VBAT on Inner2: 25.24,15.94 26.7,15.94 26.7,2.01 25.24,2.01

## Text on the board
Bottom Silkscreen Layer: 3V3 | RX | UWBINT | TX | UWBSLEEP | SWCLK | LED1 | SWDIO | LED2 | GPIO1 | UWBTX | GPIO2 | UWBRX | GND | VBAT | OFF | ON | MK8000 | SI24R1
Top Silkscreen Layer: RST | SI24R1 | Wireless UWB
